# EasyEDA Pro project ProPrj_RetroGame_2024-09-02_00-02-09_2024-09-03.epro

# Schematic RetroGame
Board Name: RetroGame; Create Date: 2024-09-02; Page Name: Sheet_1; Schematic Name: RetroGame; Update Date: 2024-09-02
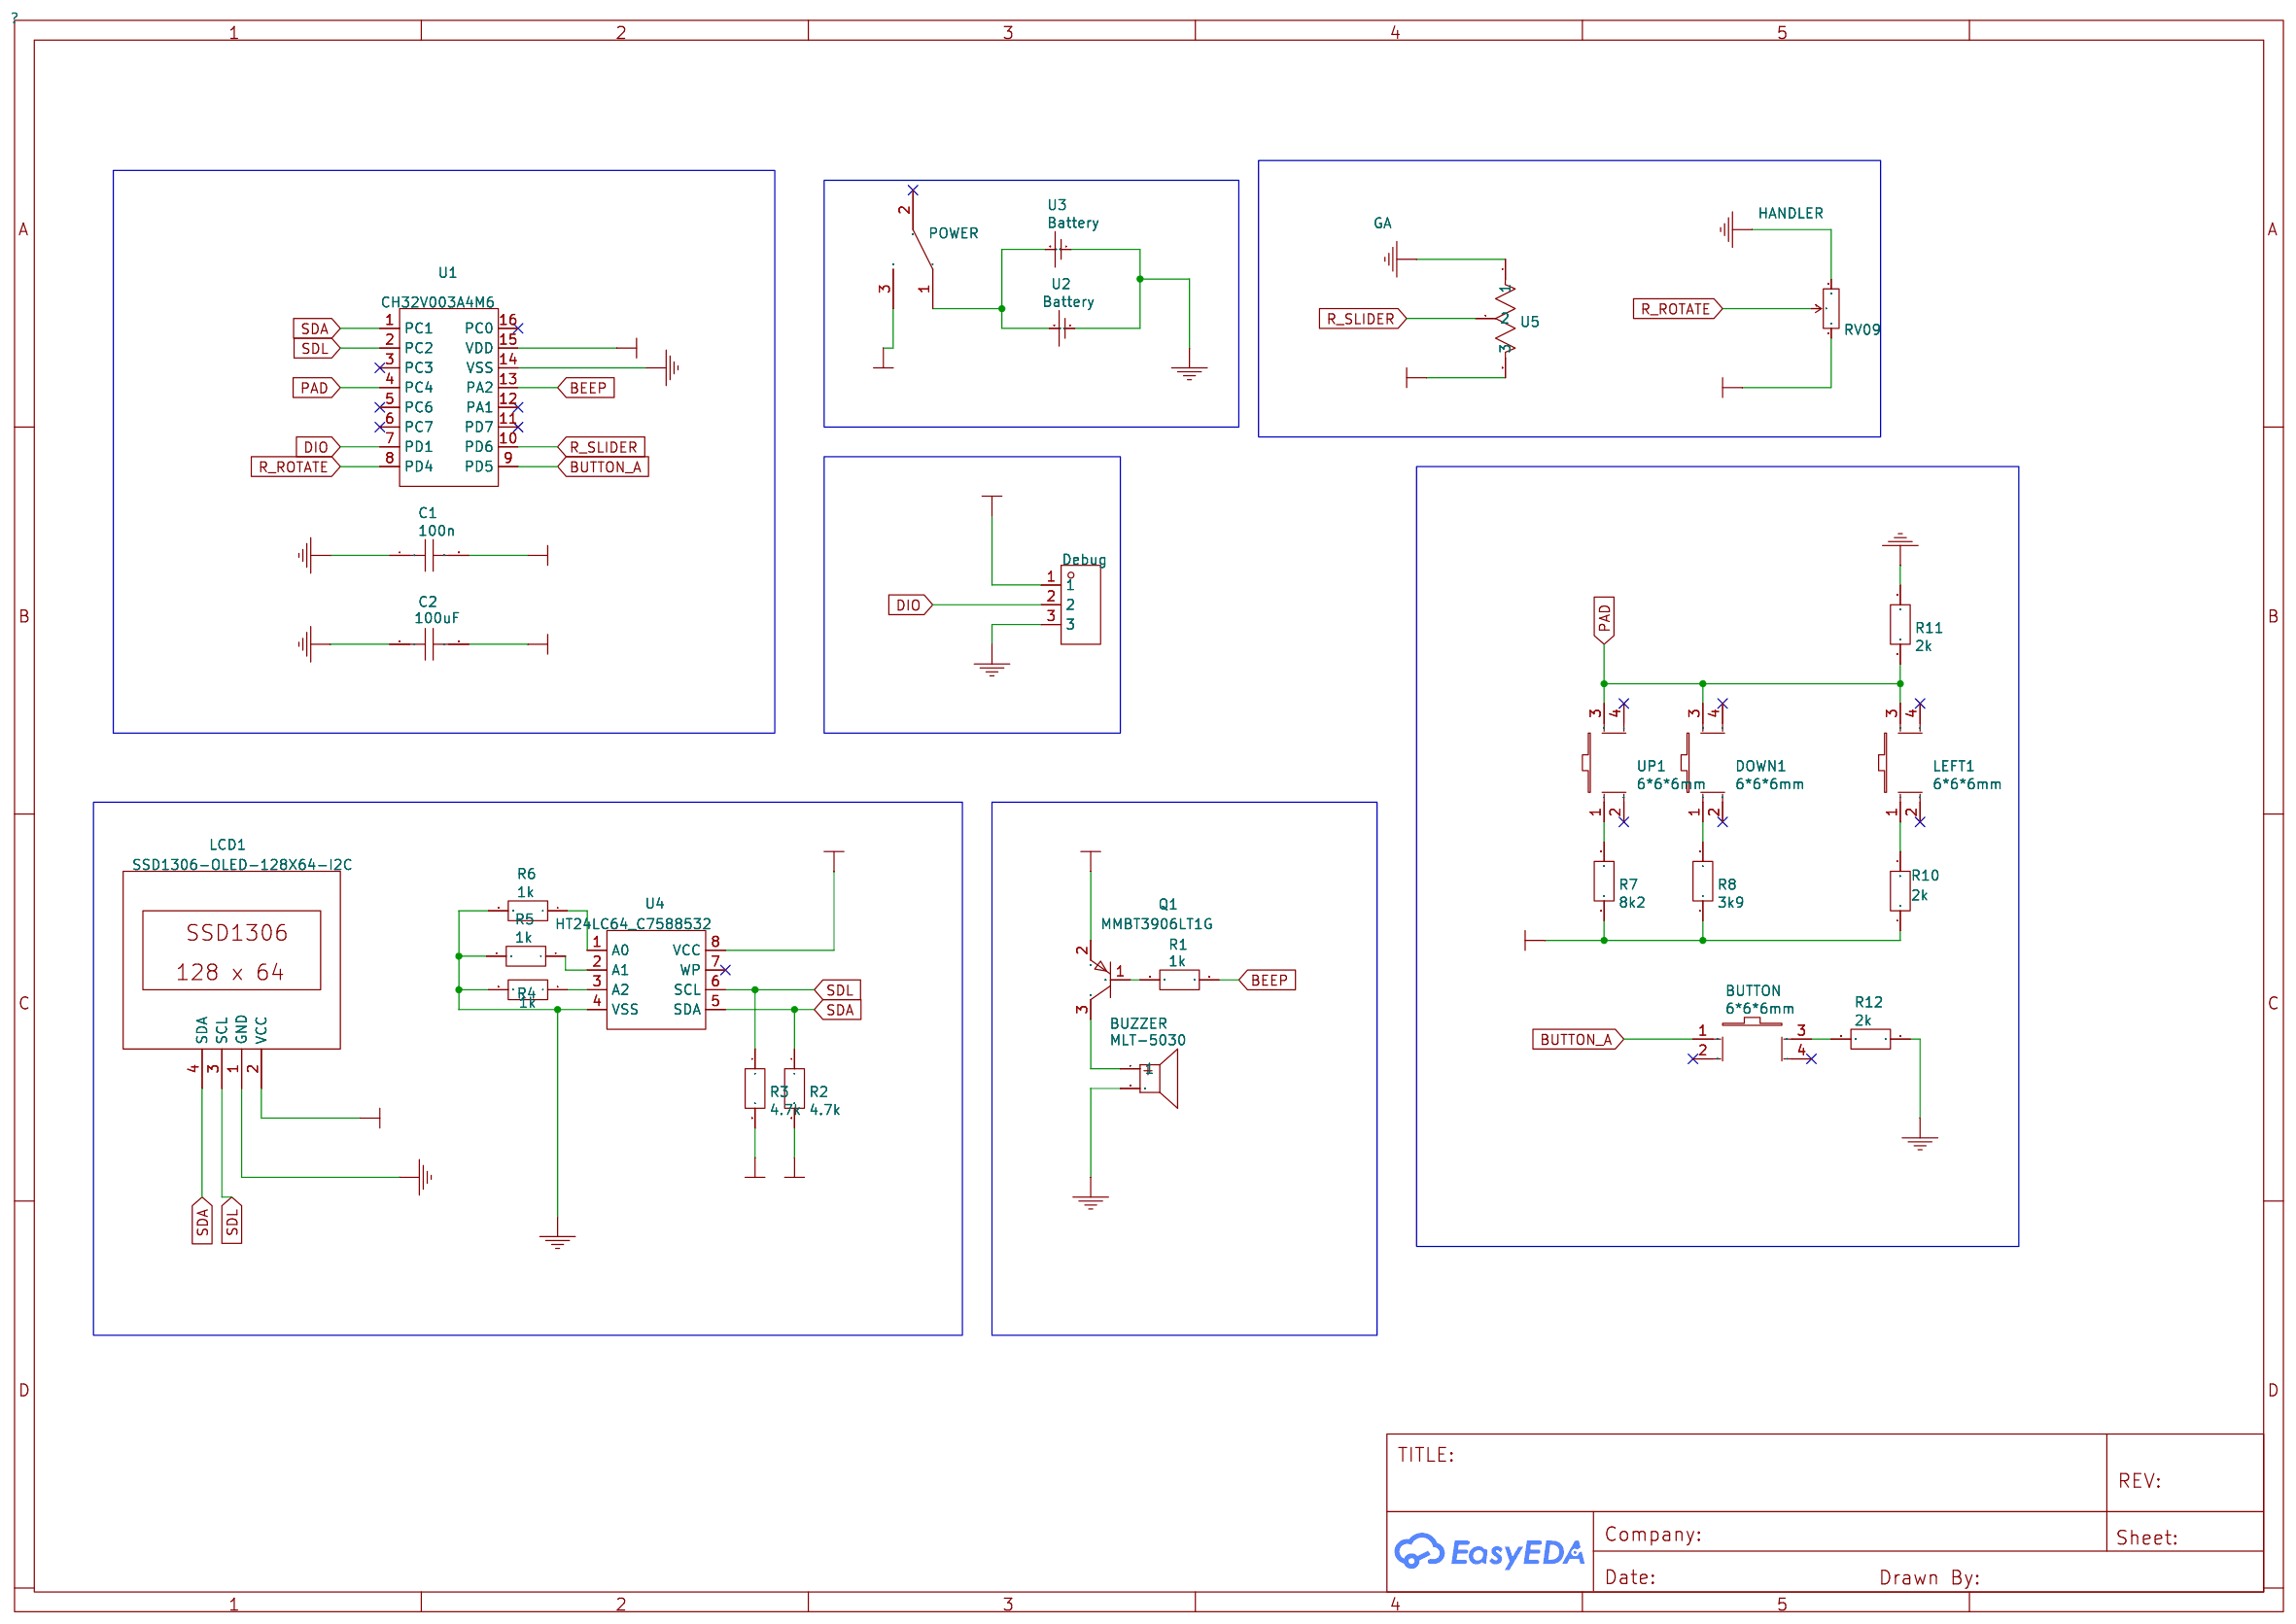
[diagram p0: schematic sheet]

## Parts
BUTTON  6*6*6mm  [KEY-6.0*6.0]
BUZZER  MLT-5030  [B-5.2*5.2]
C1  100n  [C0603]
C2  100uF  [C0603]
Debug  -  [HDR-TH_3P-P2.54-V-F]
DOWN1  6*6*6mm  [KEY-6.0*6.0]
HANDLER  RV09  [RV09]
LCD1  SSD1306-OLED-128X64-I2C  [SSD1306-OLED-128X64-I2C]
LEFT1  6*6*6mm  [KEY-6.0*6.0]
POWER  MINI SLIDE SWITCH  [MINI SLIDE SWITCH SPDT - 3PİN - 2.54MM - 11X5.5MM - SS12D00G3-FP]
Q1  MMBT3906LT1G  [PADS_SOT23-132]
R1  1k  [R0603]
R2  4.7k  [R0603]
R3  4.7k  [R0603]
R4  1k  [R0603]
R5  1k  [R0603]
R6  1k  [R0603]
R7  8k2  [0603]
R8  3k9  [0603]
R10  2k  [0603]
R11  2k  [0603]
R12  2k  [0603]
U1  CH32V003A4M6  [SOIC-16_L9.9-W3.9-P1.27-LS6.0-BL]
U2  Battery  [BATTERY-SMD-MY-2032]
U3  Battery  [BATTERY-SMD-MY-2032]
U4  HT24LC64_C7588532  [SOP-8_L4.9-W3.9-P1.27-LS6.0-BL]
U5  GA  [PSM050S-10B10KB]
UP1  6*6*6mm  [KEY-6.0*6.0]

## Library data of the parts
BUTTON DOWN1 LEFT1 UP1 = 6*6*6mm: Supplier Part: C23873; Supplier: LCSC; Manufacturer: ReliaPro; Manufacturer Part: SMD Tactile Switch6*6*6mm; image: http://image.lceda.cn/szlcsc/C23873.jpg
BUZZER = MLT-5030: Supplier Part: C95297; Supplier: LCSC; Manufacturer: HNDZ
C1 = 100n
C2 = 100uF
Debug = HDR-F_2.54_1x3P: Supplier Footprint: Through
HANDLER = RV09
LCD1 = SSD1306-OLED-128X64-I2C
POWER = MINI SLIDE SWITCH: Manufacturer Part: COM-00102; Mounted: No; Supplier: Digi-Key; Supplier Part: 1568-COM-00102-ND; Manufacturer: SparkFun Electronics; link: https://www.digikey.com/en/products/detail/sparkfun-electronics/COM-00102/14671644?s=N4IgjCBcoLQdIDGUBmBDANgZwKYBoQB7KAbXAFYA2ADhAF0BfBggJlJAFsBLAOy4AIsGLgBMcggO5cALogAW-AMoAFACIAVegyA
Q1 = MMBT3906LT1G
R1 R4-R6 = 1k
R2 R3 = 4.7k
R7 = 8k2: Manufacturer Part: 0603WAF8201T5E; Supplier: LCSC; Manufacturer: UniOhm; Supplier Part: C25981
R8 = 3k9: Manufacturer Part: 0603WAF3901T5E; Supplier: LCSC; Manufacturer: UniOhm; Supplier Part: C23018
R10-R12 = 2k: Manufacturer Part: 0603WAF2001T5E; Supplier: LCSC; Manufacturer: UniOhm; Supplier Part: C22975
U1 = CH32V003A4M6: Supplier: LCSC; Supplier Part: C5346357; Manufacturer: WCH(南京沁恒); JLCPCB Part Class: Extended Part
U2 U3 = Battery: Supplier: LCSC; Supplier Part: C964827; Manufacturer: MYOUNG(美阳); Manufacturer Part: MY-2032-10; link: https://atta.szlcsc.com/upload/public/pdf/source/20201218/C964827_472A5A3FFA887939B5A774E7907ABE67.pdf; JLCPCB Part Class: Extended Part
U4 = HT24LC64_C7588532: Supplier: LCSC; Supplier Part: C7588532; Manufacturer: HOLTEK(合泰/盛群); Manufacturer Part: HT24LC64; JLCPCB Part Class: Extended Part
U5 = GA: Manufacturer: TT Electronics; Supplier: Digi-Key; link: https://www.digikey.com/en/products/detail/tt-electronics-bi/PSM050S-10B10KB/9997286

## Nets
GND: BUZZER.2 C1.1 C2.1 Debug.3 HANDLER.3 LCD1.1(GND) R4.2 R5.2 R6.2 R11.2 R12.1 U1.14(VSS) U2.1 U3.1 U4.4(VSS) U5.1
VCC: C1.2 C2.2 Debug.1 HANDLER.1 LCD1.2(VCC) POWER.3 Q1.2(E) R2.2 R3.2 R7.1 R8.1 R10.1 U1.15(VDD) U4.8(VCC) U5.3
BEEP: R1.1 U1.13(PA2)
BUTTON_A: BUTTON.1 U1.9(PD5)
DIO: Debug.2 U1.7(PD1)
PAD: DOWN1.3 LEFT1.3 R11.1 U1.4(PC4) UP1.3
R_ROTATE: HANDLER.2 U1.8(PD4)
R_SLIDER: U1.10(PD6) U5.2
SDA: LCD1.4(SDA) R2.1 U1.1(PC1) U4.5(SDA)
SDL: LCD1.3(SCL) R3.1 U1.2(PC2) U4.6(SCL)
BUZZER_1: BUZZER.1 Q1.3(C)
Net-(BUTTON-3): BUTTON.3 R12.2
Net-(DOWN1-1): DOWN1.1 R8.2
Net-(LEFT1-1): LEFT1.1 R10.2
Net-(R7-2): R7.2 UP1.1
R1_2: Q1.1(B) R1.2
U2_2: POWER.1 U2.2 U3.2
U4_1: R6.1 U4.1(A0)
U4_2: R5.1 U4.2(A1)
U4_3: R4.1 U4.3(A2)

Not connected (* = marked no-connect by the designer): BUTTON 2* 4*; DOWN1 2* 4*; LEFT1 2* 4*; POWER 2*; U1 3(PC3)* 5(PC6)* 6(PC7)* 11(PD7)* 12(PA1)* 16(PC0)*; U4 7(WP)*; UP1 2* 4*

# Board PCB_RetroGame
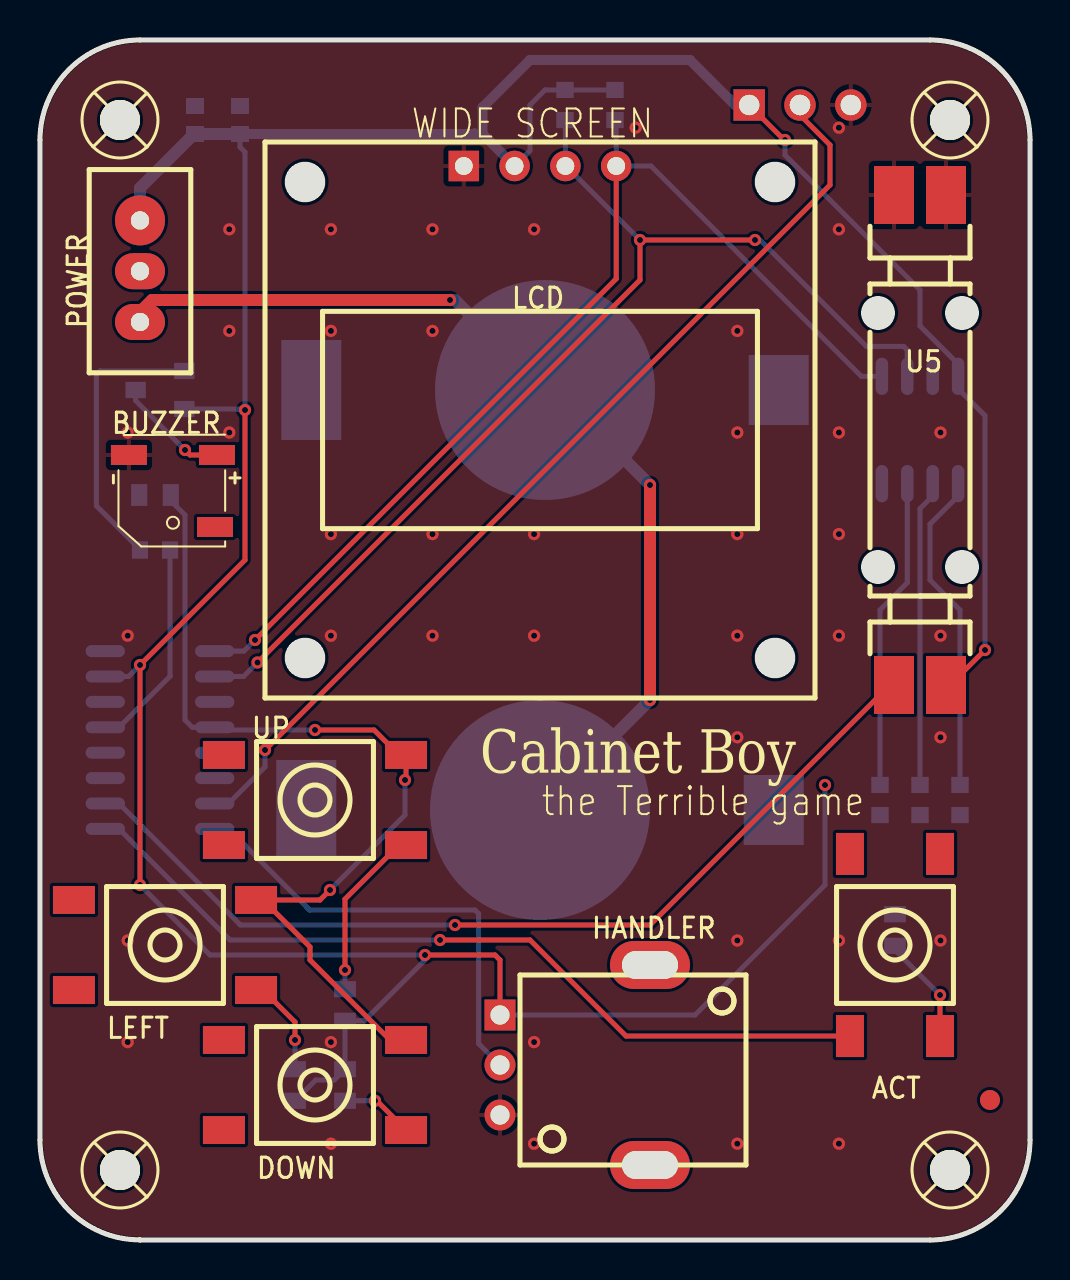
[diagram p1: board, top side]
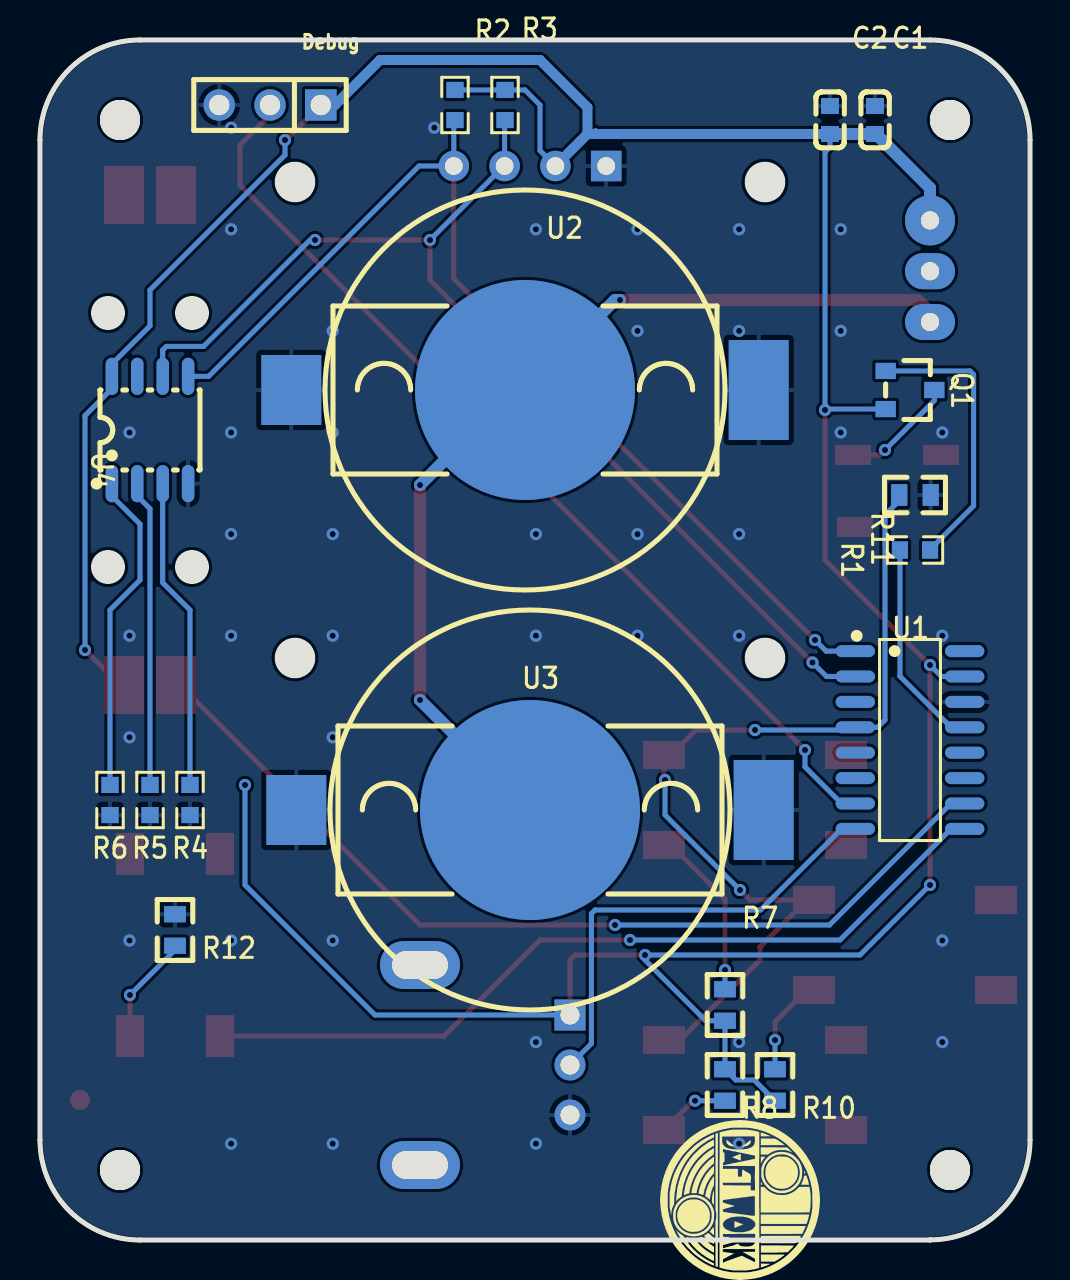
[diagram p2: board, bottom side, seen from below]

Outline 49.5 x 60 mm; copper layers: Top Layer, Bottom Layer. Coordinates in mm from the lower left corner of the outline.
Outline path: 0,55 arc(1.46,58.54) 5,60 44.5,60 arc(48.04,58.54) 49.5,55 49.5,5 arc(48.04,1.46) 44.5,0 5,0 arc(5,0) 4.99,0.01 arc(1.46,1.47) 0,5 0,55
Stack: Top Layer 0.035mm / Dielectric1 1.51mm FR4 er 4.5 / Bottom Layer 0.035mm

## Design rules (mm)
template: User Custom Config
spacing Default (default): track to track 0.152, other pairs 0 to 0.152
track width Default (default): min 0.254, default 0.254, max 25.4
differential pair differentialPair (default): width min 0.127, default 0.254, max 2.54; gap min 0.152, default 0.152
via Default (default): diameter min 0.61, default 0.61, max 100.025; hole min 0.305, default 0.305, max 59.995

## Placement (name value [footprint] x y rotation side)
ACT  6*6*6mm  [KEY-6.0*6.0]  42.75 14.75 270 top
BUZZER  MLT-5030  [B-5.2*5.2]  8.75 39.25 90 top
C1  100n  [C0603]  7.75 56 270 bottom
C2  100uF  [C0603]  10 56 270 bottom
Debug  -  [HDR-TH_3P-P2.54-V-F]  38 56.75 0 bottom
DOWN  6*6*6mm  [KEY-6.0*6.0]  13.75 7.75 0 top
HANDLER  -  [RV09]  30.5 8.75 270 top
LCD  -  [SSD1306-OLED-128X64-I2C]  25 41 0 top
LEFT  6*6*6mm  [KEY-6.0*6.0]  6.25 14.75 0 top
MARK1  -  [Mark-Point-1mm]  47.5 7 0 top
POWER  MINI SLIDE SWITCH  [MINI SLIDE SWITCH SPDT - 3PİN - 2.54MM - 11X5.5MM - SS12D00G3-FP]  5 53.5 180 top
Q1  MMBT3906LT1G  [PADS_SOT23-132]  6 42.5 270 bottom
R1  1k  [R0603]  5.75 34.5 180 bottom
R2  4.7k  [R0603]  28.75 56.75 90 bottom
R3  4.7k  [R0603]  26.25 56.75 90 bottom
R4  1k  [R0603]  42 22 270 bottom
R5  1k  [R0603]  44 22 270 bottom
R6  1k  [R0603]  46 22 270 bottom
R7  8k2  [0603]  15.25 11.75 90 bottom
R8  3k9  [0603]  15.25 7.75 270 bottom
R10  2k  [0603]  12.75 7.75 90 bottom
R11  2k  [0603]  5.75 37.25 180 bottom
R12  2k  [0603]  42.75 15.5 270 bottom
SCREW1  -  [Screw-Hole-M2]  4 56 0 top
SCREW2  -  [Screw-Hole-M2]  45.5 56 0 top
SCREW3  -  [Screw-Hole-M2]  4 3.5 0 top
SCREW4  -  [Screw-Hole-M2]  45.5 3.5 0 top
U1  CH32V003A4M6  [SOIC-16_L9.9-W3.9-P1.27-LS6.0-BL]  6 25 270 bottom
U2  Battery  [BATTERY-SMD-MY-2032]  25.25 42.5 270 bottom
U3  Battery  [BATTERY-SMD-MY-2032]  25 21.5 270 bottom
U4  HT24LC64_C7588532  [SOP-8_L4.9-W3.9-P1.27-LS6.0-BL]  44 40.5 180 bottom
U5  GA  [PSM050S-10B10KB]  44 40 270 top
UP  6*6*6mm  [KEY-6.0*6.0]  13.75 22 0 top

## Footprints (pads in the part's own frame, mm; a bottom-side part is the same pattern mirrored in y, then rotated)
0603
  rect 0.813x1.092 smd: 1(-0.787,0) 2(0.787,0)
B-5.2*5.2
  rect 1x1.8 smd: 1(0.001,-0.099) 2(0.001,4.303) 3(-3.6,0)
BATTERY-SMD-MY-2032
  rect 3.5x3 smd: 1(0,-11.684)
  rect 5x3 smd: 1(0,11.684)
  round 11 smd: 2(0,0)
C0603
  rect 0.8x0.9 smd: 1(-0.7,0) 2(0.7,0)
HDR-TH_3P-P2.54-V-F
  rect 1.575x1.575 hole 1.02: 1(-2.54,0)
  round 1.575 hole 1.02: 2(0,0) 3(2.54,0)
KEY-6.0*6.0
  rect 2.1x1.4 smd: 1(4.553,-2.252) 2(-4.553,-2.252) 3(4.553,2.252) 4(-4.553,2.252)
Mark-Point-1mm
  round 1 smd: 1(0,0)
MINI SLIDE SWITCH SPDT - 3PİN - 2.54MM - 11X5.5MM - SS12D00G3-FP
  oval 2.5x1.8 hole 0.914: 1(0,7.6) 2(0,5.06)
  oval 2.5x2.5 hole 0.914: 3(0,2.52)
PADS_SOT23-132
  rect 0.813x1.016 smd: 1(-0.953,-1.219) 2(0.953,-1.219) 3(0,1.219)
PSM050S-10B10KB
  rect 2.9x2 smd: 1(-12.25,1.3) 1(-12.25,-1.3) 2(12.25,-1.3) 3(12.25,1.3)
R0603
  rect 0.806x0.864 smd: 1(-0.753,0) 2(0.753,0)
RV09
  rect 1.55x1.55 hole 0.955x0.95: 1(-2.5,-7.5)
  round 1.55 hole 0.955x0.95: 2(0,-7.5) 3(2.5,-7.5)
  oval 2.4x4 hole 1.4x2.8: GND(-5,0) GND(5,0)
Screw-Hole-M2
  round 2 hole 2: 1(0,0)
SOIC-16_L9.9-W3.9-P1.27-LS6.0-BL
  oval 0.602x1.971 smd: 1(-4.445,-2.736) 2(-3.175,-2.736) 3(-1.905,-2.736) 4(-0.635,-2.736) 5(0.635,-2.736) 6(1.905,-2.736) 7(3.175,-2.736) 8(4.445,-2.736) 9(4.445,2.736) 10(3.175,2.736) 11(1.905,2.736) 12(0.635,2.736) 13(-0.635,2.736) 14(-1.905,2.736) 15(-3.175,2.736) 16(-4.445,2.736)
SOP-8_L4.9-W3.9-P1.27-LS6.0-BL
  oval 0.63x1.865 smd: 1(-1.905,-2.683) 2(-0.635,-2.683) 3(0.635,-2.683) 4(1.905,-2.683) 5(1.905,2.683) 6(0.635,2.683) 7(-0.635,2.683) 8(-1.905,2.683)
SSD1306-OLED-128X64-I2C
  rect 1.524x1.524 hole 0.889: 1(-3.81,12.7)
  round 1.524 hole 0.889: 2(-1.27,12.7) 3(1.27,12.7) 4(3.81,12.7)

## Nets
GND: BUZZER.2 C1.1 C2.1 Debug.3 HANDLER.3 LCD.1 R4.2 R5.2 R6.2 R11.2 R12.1 U1.14 U2.1 U3.1 U4.4 U5.1
VCC: C1.2 C2.2 Debug.1 HANDLER.1 LCD.2 POWER.3 Q1.2 R2.2 R3.2 R7.1 R8.1 R10.1 U1.15 U4.8 U5.3
BEEP: R1.1 U1.13
BUTTON_A: ACT.1 U1.9
BUZZER_1: BUZZER.1 Q1.3
DIO: Debug.2 U1.7
DOWN1_1: DOWN.1 R8.2
LEFT1_1: LEFT.1 R10.2
PAD: DOWN.3 LEFT.3 R11.1 U1.4 UP.3
R1_2: Q1.1 R1.2
R12_2: ACT.3 R12.2
R_ROTATE: HANDLER.2 U1.8
R_SLIDER: U1.10 U5.2
SDA: LCD.4 R2.1 U1.1 U4.5
SDL: LCD.3 R3.1 U1.2 U4.6
U2_2: POWER.1 U2.2 U3.2
U4_1: R6.1 U4.1
U4_2: R5.1 U4.2
U4_3: R4.1 U4.3
UP1_1: R7.2 UP.1

Pads without a net: ACT 2 4; BUZZER 3; DOWN 2 4; HANDLER GND; LEFT 2 4; MARK1 1; POWER 2; SCREW1 1; SCREW2 1; SCREW3 1; SCREW4 1; U1 3 5 6 11 12 16; U4 7; UP 2 4

## Via types
v1: diameter 0.61, hole 0.305, Top Layer to Bottom Layer, 66 vias

## Routing (per net, layer and track width the routed paths; a pad name or vN(x,y) marks a point on that pad's centre or on a via; arc(x,y) is an arc through that point)
GND:
  vias: v1(4.39,40.38) v1(4.39,30.22) v1(4.39,14.97) v1(4.39,9.9) v1(9.47,50.53) v1(9.47,45.45) v1(9.47,40.38) v1(14.54,50.53) v1(14.54,45.45) v1(14.54,35.3) v1(14.54,30.22) v1(14.54,9.9) v1(14.54,4.81) v1(19.62,50.53) v1(19.62,45.45) v1(19.62,35.3) v1(19.62,30.22) v1(24.71,50.53) v1(24.71,35.3) v1(24.71,30.22) v1(24.71,9.9) v1(24.71,4.81) v1(29.78,55.61) v1(34.87,45.45) v1(34.87,40.38) v1(34.87,35.3) v1(34.87,30.22) v1(34.87,25.14) v1(34.87,14.97) v1(34.87,4.81) v1(39.94,55.61) v1(39.94,50.53) v1(39.94,40.38) v1(39.94,35.3) v1(39.94,30.22) v1(39.94,14.97) v1(39.94,4.81) v1(45.03,40.38) v1(45.03,30.22) v1(45.03,25.14) v1(45.03,14.97)
VCC: length 183.1
  Top Layer w0.254: v1(5,17.75) v1(5,28.75) 10.25,34 v1(10.25,41.5) ; U5.3 45.5,27.75 v1(47.25,29.5) ; v1(37.25,55) 37.21,55 Debug.1 ; v1(19.25,14.25) 22.75,14.25 23,14 HANDLER.1
  Bottom Layer w0.254: v1(10.25,41.5) 10.25,54.4 10,54.65 C2.2 ; v1(39.25,22.75) 39.25,17.75 32.75,11.25 HANDLER.1 ; U1.15 4.42,28.17 v1(5,28.75) ; R2.2 R3.2 25.25,57.5 24.5,56.75 24.5,54.47 LCD.2 ; v1(37.25,55) 37.25,54.25 44,47.5 44,45.7 45.91,43.8 U4.8 45.91,42.56 47.25,41.22 v1(47.25,29.5) ; Q1.2 10.19,41.55 ; v1(5,17.75) 8.5,14.25 v1(19.25,14.25) 19.25,14 16.21,10.96 R7.1 R8.1 14.71,8 13.79,8 R10.1 ; 21.72,55.47 21.72,55.3
  Bottom Layer w0.5: 22.13,55.3 22.13,56.63 24.5,59 32.5,59 34.75,56.75 Debug.1 ; 22.13,55.3 LCD.2 ; 22.13,55.3 C2.2
  Bottom Layer w0.6: C2.2 C1.2 7.7,55.3 5,52.6 5,51.98 5.25,51.73
BEEP: length 10.6
  Bottom Layer w0.254: U1.13 3.95,25.64 6.5,28.19 R1.1
BUTTON_A: length 41.6
  Top Layer w0.254: v1(20,15) 24.5,15 29.3,10.2 ACT.1
  Bottom Layer w0.254: 3.26,20.51 U1.9 3.95,20.56 4.5,20 4.5,20 9.5,15 v1(20,15)
BUZZER_1: length 5.7
  Top Layer w0.254: BUZZER.1 7.5,39.25 v1(7.25,39.5)
  Bottom Layer w0.254: v1(7.25,39.5) 4.78,41.97 Q1.3
DIO: length 48.7
  Top Layer w0.254: v1(11.25,24.5) 39.5,52.75 39.5,54.75 38,56.25 Debug.2
  Bottom Layer w0.254: v1(11.25,24.5) 11.25,23.66 9.42,21.83 U1.7
DOWN1_1: length 3.7
  Top Layer w0.254: v1(16.75,6.96) 16.84,6.96 DOWN.1
  Bottom Layer w0.254: R8.2 v1(16.75,6.96)
LEFT1_1: length 5
  Top Layer w0.254: LEFT.1 11.15,12.5 12.75,10.9 v1(12.75,10)
  Bottom Layer w0.254: R10.2 v1(12.75,10)
PAD: length 46
  Top Layer w0.254: v1(18.25,23) 18.3,23.05 UP.3 17.95,24.25 16.7,25.5 v1(13.75,25.5) ; DOWN.3 17.5,10 13.5,14 13.5,14.65 11.15,17 ; LEFT.3 11.15,17 ; 11.15,17 14,17 v1(14.5,17.5)
  Bottom Layer w0.254: R11.1 6.54,36.96 7.25,36.25 7.25,26 7.61,25.64 U1.4 8.87,25.5 v1(13.75,25.5) ; v1(14.5,17.5) 18.25,21.25 v1(18.25,23)
R1_2: length 14.1
  Bottom Layer w0.254: Q1.1 3,43.45 2.82,43.27 2.82,36.7 5,34.53 R1.2
R12_2: length 5.4
  Top Layer w0.254: ACT.3 v1(45,12.25)
  Bottom Layer w0.254: R12.2 42.75,14.5 v1(45,12.25)
R_ROTATE: length 23
  Bottom Layer w0.254: U1.8 9.42,20.56 13.47,16.5 21.75,16.5 21.93,16.32 21.93,9.82 HANDLER.2
R_SLIDER: length 46.9
  Top Layer w0.254: v1(20.75,15.75) 30.5,15.75 42.5,27.75 U5.2
  Bottom Layer w0.254: v1(20.75,15.75) 10.02,15.75 3.95,21.83 U1.10
SDA: length 53.4
  Top Layer w0.254: LCD.4 28.81,48.06 v1(10.75,30)
  Bottom Layer w0.254: v1(10.75,30) 10.19,29.44 U1.1 ; R2.1 28.81,55.94 LCD.4 30.55,53.7 41.07,43.18 U4.5
SDL: length 56
  Top Layer w0.254: v1(35.75,50) v1(30,50) 30,48 v1(10.88,28.88)
  Bottom Layer w0.254: U1.2 10.18,28.17 v1(10.88,28.88) ; v1(35.75,50) 36,50 41.32,44.68 43.19,44.68 43.37,44.5 U4.6 ; R3.1 26.27,55.98 LCD.3 26.3,53.7 v1(30,50)
U2_2: length 48.6
  Top Layer w0.6: v1(20.5,47) 5.6,47 5,46.4 POWER.1 ; v1(30.5,27) v1(30.5,37.75)
  Bottom Layer w0.6: v1(20.5,47) 20.75,47 U2.2 25.75,42.5 v1(30.5,37.75) ; U3.2 v1(30.5,27)
U4_1: length 16.3
  Bottom Layer w0.254: R6.1 46,31.5 44.5,33 44.5,35.8 45.91,37.2 U4.1
U4_2: length 15.3
  Bottom Layer w0.254: R5.1 44,36.56 44.63,37.2 U4.2
U4_3: length 15.6
  Bottom Layer w0.254: U4.3 43.37,32.86 42,31.5 R4.1
UP1_1: length 8.7
  Top Layer w0.254: v1(15.25,13.5) 15.25,17.05 17.95,19.75 UP.1
  Bottom Layer w0.254: v1(15.25,13.5) R7.2

## Copper pours and planes (outline as drawn; the poured copper is in the pictures)
GND on Top Layer: 0,60 50,60 50,0 0,0
GND on Bottom Layer: 0,60 50,60 50,0 0,0

## Text on the board
Top Silkscreen Layer: WIDE SCREEN | the Terrible game | Cabinet Boy
